# EAGLE schematic mic-preamp (EAGLE 9.2.2)
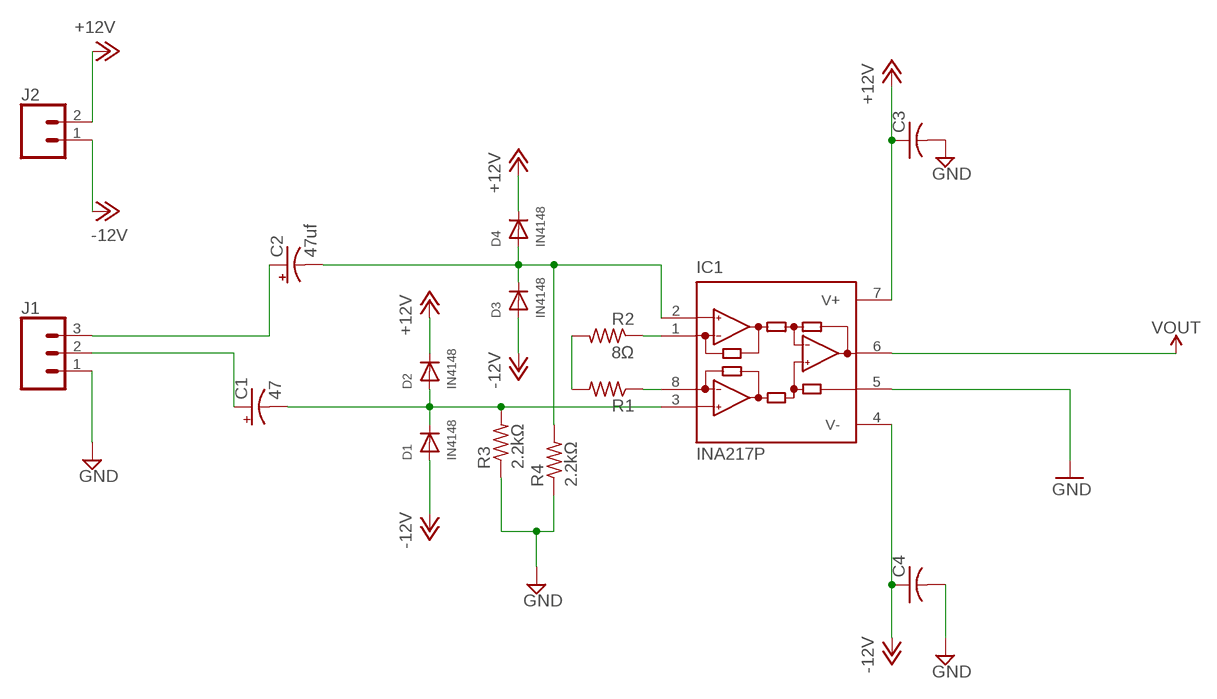
[diagram p0: schematic, sheet 1]

## Parts
C1  47  CPOL-USE7.5-16  [E7,5-16]
C2  47uf  CPOL-USE7.5-16  [E7,5-16]
C3  C-US025-024X044  [C025-024X044]
C4  C-US025-024X044  [C025-024X044]
D1  IN4148  DIODEDO-1N4148  [DO-1N4148]
D2  IN4148  DIODEDO-1N4148  [DO-1N4148]
D3  IN4148  DIODEDO-1N4148  [DO-1N4148]
D4  IN4148  DIODEDO-1N4148  [DO-1N4148]
IC1  INA217P  [DIL08]
J1  CONN_03JST-PTH  [JST-3-PTH]
J2  CONN_02POLAR  [MOLEX-1X2]
R1  R-US_0204/7  [0204/7]
R2  8Ω  R-US_0204/7  [0204/7]
R3  2.2kΩ  R-US_0204/7  [0204/7]
R4  2.2kΩ  R-US_0204/7  [0204/7]

## Nets
+12V: C3.1 D2.C D4.C IC1.7(V+) J2.2
-12V: C4.1 D1.A D3.A IC1.4(V-) J2.1
GND: C3.2 C4.2 IC1.5(REF) J1.1 R3.1 R4.1
N$1: C1.- D1.C D2.A IC1.3(+IN) R3.2
N$2: C2.- D3.C D4.A IC1.2(-IN) R4.2
N$3: C1.+ J1.2
N$5: IC1.8(RG2) R1.1
N$6: R1.2 R2.2
N$7: IC1.1(RG1) R2.1
N$8: C2.+ J1.3
VOUT: IC1.6(OUT)

## Library data of the parts
C1 C2 = adafruit:CPOL-US: POLARIZED CAPACITOR, American symbol
C3 C4 = adafruit:C-US: CAPACITOR, American symbol
D1-D4 = adafruit:DIODE: Diode SMADIODE - SMA Surface Mount Package 20V 1A Schottky Diode Digikey: 641-1014-6-ND DO-1N4148 - Through Hole Small Current Diode SOD-123 20V 1 A (.5mV Vf) Schottky Diode - Digikey: MBRX120TPMSCT-ND SOD-323 10V 570mA (.38mV Vf, 3ns) Schottky Diode - Digikey: ZLLS410CT-ND SOD-523 30V 30mA Schottky Diode (RB751S-40TE61) - Digikey: RB751S-40TE61CT-ND SOT23-R/W - SOT23 Package (R = Solder Paste/Reflow Ovens, W = Hand-Soldering) BAT54Film 40V 300mA - Digikey: 497-7162-1-ND
IC1 = burr-brown:INA217: Low-Noise, Low-Distortion INSTRUMENTATION AMPLIFIER Replacement for SSM2017 Source: http://focus.ti.com/lit/ds/symlink/ina217.pdf; MF: TEXAS INSTRUMENTS; MPN: INA217AIP; OC_FARNELL: 1212423; OC_NEWARK: 74C9859
J1 = SparkFun-Connectors:CONN_03: Multi connection point. Often used as Generic Header-pin footprint for 0.1 inch spaced/style header connections On any of the 0.1 inch spaced packages, you can populate with these: Break Away Headers - Straight <https://www.sparkfun.com/products/116> (PRT-00116) Break Away Male Headers - Right Angle <https://www.sparkfun.com/products/553> (PRT-00553) Female Headers <https://www.sparkfun.com/products/115> (PRT-00115) Break Away Headers - Machine Pin <https://www.sparkfun.com/products/117> (PRT-00117) Break Away Female Headers - Swiss Machine Pin <https://www.sparkfun.com/products/743> (PRT-00743) Stackable Header - 3 Pin (Female, 0.1") <https://www.sparkfun.com/products/13875> (PRT-13875) For SCREWTERMINALS and SPRING TERMINALS visit here: Screw Terimnals on SparkFun.com <https://www.sparkfun.com/search/results?term=Screw+Terminals> (5mm/3.5mm/2.54mm spacing) This device is also useful as a general connection point to wire up your design to another part of your project. Our various solder wires solder well into these plated through hole pads. Hook-Up Wire - Assortment (Stranded, 22 AWG) <https://www.sparkfun.com/products/11375> (PRT-11375) Hook-Up Wire - Assortment (Solid Core, 22 AWG) <https://www.sparkfun.com/products/11367> (PRT-11367) View the entire wire category on our website here <https://www.sparkfun.com/categories/141> Special notes: Molex polarized connector foot print use with SKU : PRT-08232 with associated crimp pins and housings.; PROD_ID: WIRE-10037; SF_ID: PRT-09915
J2 = SparkFun-Connectors:CONN_02: Multi connection point. Often used as Generic Header-pin footprint for 0.1 inch spaced/style header connections On any of the 0.1 inch spaced packages, you can populate with these: Break Away Headers - Straight <https://www.sparkfun.com/products/116> (PRT-00116) Break Away Male Headers - Right Angle <https://www.sparkfun.com/products/553> (PRT-00553) Female Headers <https://www.sparkfun.com/products/115> (PRT-00115) Break Away Headers - Machine Pin <https://www.sparkfun.com/products/117> (PRT-00117) Break Away Female Headers - Swiss Machine Pin <https://www.sparkfun.com/products/743> (PRT-00743) For SCREWTERMINALS and SPRING TERMINALS visit here: Screw Terimnals on SparkFun.com <https://www.sparkfun.com/search/results?term=Screw+Terminals> (5mm/3.5mm/2.54mm spacing) This device is also useful as a general connection point to wire up your design to another part of your project. Our various solder wires solder well into these plated through hole pads. Hook-Up Wire - Assortment (Stranded, 22 AWG) <https://www.sparkfun.com/products/11375> (PRT-11375) Hook-Up Wire - Assortment (Solid Core, 22 AWG) <https://www.sparkfun.com/products/11367> (PRT-11367) View the entire wire category on our website here <https://www.sparkfun.com/categories/141> Special notes: Molex polarized connector foot print use with: PRT-08233 with associated crimp pins and housings. 2.54_SCREWTERM for use with PRT-10571. 3.5mm Screw Terminal footprints for PRT-08084 5mm Screw Terminal footprints for use with PRT-08432; SF_ID: PRT-09918
R1-R4 = adafruit:R-US_: RESISTOR, American symbol